# EAGLE design esquema v5 (EAGLE 9.6.2)
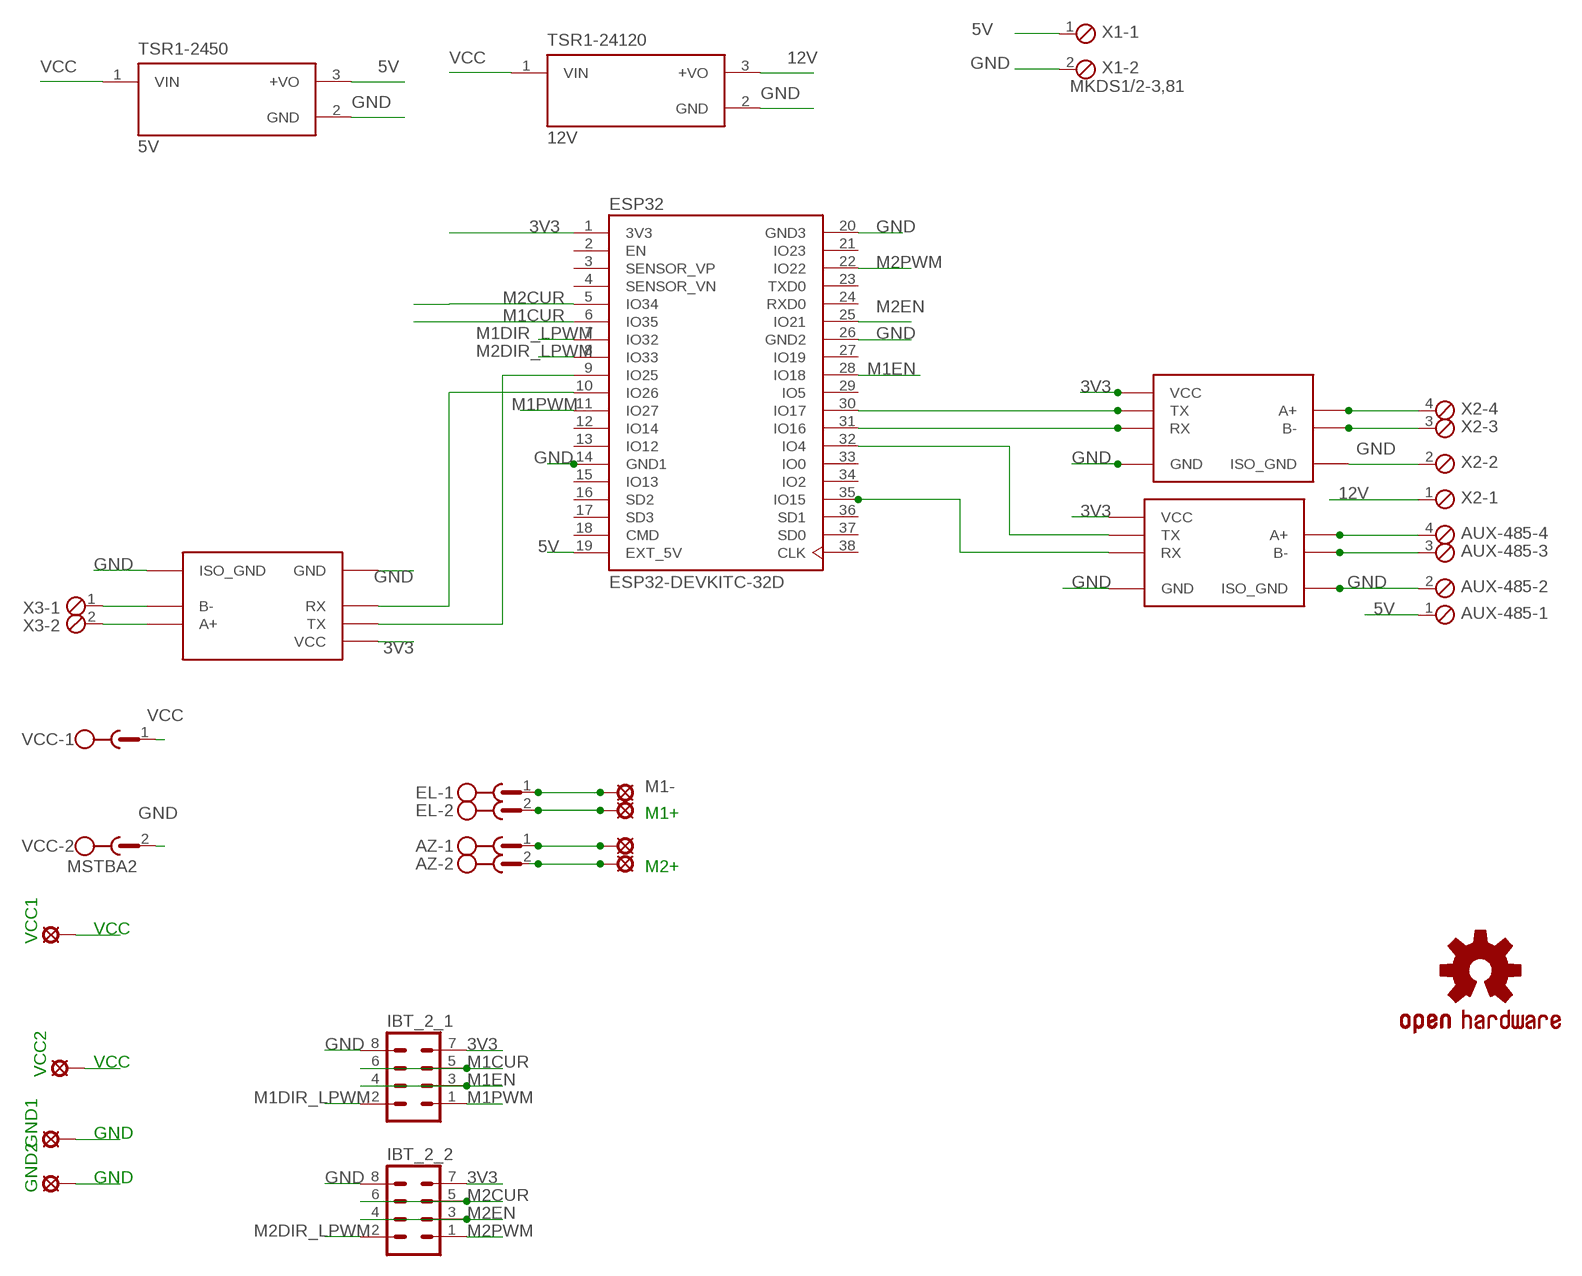
[diagram p0: schematic, sheet 1]

## Parts
AUX-485  MKDS1/4-3,81  [4POL381]
AZ  MSTBA2  [MSTBA2]
EL  MSTBA2  [MSTBA2]
ESP32  ESP32-DEVKITC-32D  [MODULE_ESP32-DEVKITC-32D]
GND1  LSP10  [LSP10]
GND2  LSP10  [LSP10]
IBT_2_1  IBT_2_1  MA04-2  [MA04-2]
IBT_2_2  MA04-2  [MA04-2]
LOGO1  OSHW-LOGOMINI  [OSHW-LOGO-MINI]
M1+  LSP10  [LSP10]
M1-  LSP10  [LSP10]
M2  LIMNOTECH_SMC_RS485  [LIMNOTECH_SMC_RS485]
M2+  LSP10  [LSP10]
M2-  M2-  LSP10  [LSP10]
M3  LIMNOTECH_SMC_RS485  [LIMNOTECH_SMC_RS485]
M4  LIMNOTECH_SMC_RS485  [LIMNOTECH_SMC_RS485]
TSR1-2450  5V  K7803-500R3  [CONV_K7803-500R3]
TSR1-24120  12V  K7803-500R3  [CONV_K7803-500R3]
VCC  MSTBA2  [MSTBA2]
VCC1  LSP10  [LSP10]
VCC2  LSP10  [LSP10]
X1  MKDS1/2-3,81  [2POL381]
X2  MKDS1/4-3,81  [4POL381]
X3  MKDS1/2-3,81  [2POL381]

## Nets
3V3: ESP32.1(3V3) IBT_2_1.7 IBT_2_2.7 M2.VCC M3.VCC M4.VCC
5V: AUX-485.1 ESP32.19(EXT_5V) TSR1-2450.3(+VO) X1.1
12V: TSR1-24120.3(+VO) X2.1
GND [power]: AUX-485.2 ESP32.14(GND1) ESP32.20(GND3) ESP32.26(GND2) GND1.MP GND2.MP IBT_2_1.8 IBT_2_2.8 M2.GND M2.GND_ISO(ISO_GND) M3.GND M3.GND_ISO(ISO_GND) M4.GND M4.GND_ISO(ISO_GND) TSR1-2450.2(GND) TSR1-24120.2(GND) VCC.2 X1.2 X2.2
M1+ [power]: EL.2 M1+.MP
M1-: EL.1 M1-.MP
M1CUR: ESP32.6(IO35) IBT_2_1.5 IBT_2_1.6
M1DIR_LPWM: ESP32.7(IO32) IBT_2_1.2
M1EN: ESP32.28(IO18) IBT_2_1.3 IBT_2_1.4
M1PWM: ESP32.11(IO27) IBT_2_1.1
M2+ [power]: AZ.2 M2+.MP
M2CUR: ESP32.5(IO34) IBT_2_2.5 IBT_2_2.6
M2DIR_LPWM: ESP32.8(IO33) IBT_2_2.2
M2EN: ESP32.25(IO21) IBT_2_2.3 IBT_2_2.4
M2PWM: ESP32.22(IO22) IBT_2_2.1
N$1: M4.B- X2.3
N$2: AUX-485.4 M2.A+
N$3: AZ.1 M2-.MP
N$4: ESP32.32(IO4) M2.TX
N$5: ESP32.10(IO26) M3.RX
N$6: ESP32.9(IO25) M3.TX
N$7: ESP32.31(IO16) M4.RX
N$8: ESP32.30(IO17) M4.TX
N$9: M3.B- X3.1
N$10: M3.A+ X3.2
N$11: ESP32.35(IO15) M2.RX
N$12: AUX-485.3 M2.B-
N$24: M4.A+ X2.4
VCC [power]: TSR1-2450.1(VIN) TSR1-24120.1(VIN) VCC1.MP VCC2.MP VCC.1
Unconnected: ESP32.2(EN) ESP32.3(SENSOR_VP) ESP32.4(SENSOR_VN) ESP32.12(IO14) ESP32.13(IO12) ESP32.15(IO13) ESP32.16(SD2) ESP32.17(SD3) ESP32.18(CMD) ESP32.21(IO23) ESP32.23(TXD0) ESP32.24(RXD0) ESP32.27(IO19) ESP32.29(IO5) ESP32.33(IO0) ESP32.34(IO2) ESP32.36(SD1) ESP32.37(SD0) ESP32.38(CLK)

## Library data of the parts
AUX-485 X2 = con-phoenix-381:MKDS1/4-3,81: MKDS 1/4-3,81 - Order No. 1727036 Pitch: 3,81mm Number of terminals: 4 Rated Voltage: 160V Maximum load current/ cross section: 12A/1.5mm2-AWG16 Housing Interlocking: none Color: Green
AZ EL VCC = con-phoenix-508:MSTBA2: PHOENIX; MF: FARNELL; MPN: 1757242; OC_FARNELL: 3705171; OC_NEWARK: 71C4161
ESP32 = ESP32-DEVKITC-32D:ESP32-DEVKITC-32D: Eval Board For Esp-Wroom-32 Check prices <https://pricing.snapeda.com/parts/ESP32-DEVKITC-32D/Espressif%20Systems/view-part?ref=eda>; AVAILABILITY: Warning; DESCRIPTION: EVAL BOARD FOR ESP-WROOM-32; MF: Espressif Systems; MP: ESP32-DEVKITC-32D; PACKAGE: None; PRICE: None; PURCHASE-URL: https://pricing.snapeda.com/search/part/ESP32-DEVKITC-32D/?ref=eda
GND1 GND2 M1+ M1- M2+ M2- VCC1 VCC2 = solpad:LSP10: SOLDER PAD drill 1.0 mm, distributor Buerklin, 12H555
IBT_2_1 IBT_2_2 = con-lstb:MA04-2: PIN HEADER; OC_FARNELL: unknown; OC_NEWARK: unknown
LOGO1 = SparkFun-Aesthetics:OSHW-LOGO: Open-Source Hardware (OSHW) Logo This logo indicates the piece of hardware it is found on incorporates a OSHW license and/or adheres to the definition of open source hardware found here: http://freedomdefined.org/OSHW
M2-M4 = aamilibreria:LIMNOTECH_SMC_RS485: Layout for connecting SMC RS-485 module Module <https://www.amazon.com/SMAKN%C2%AE-Adapter-Serial-Converter-Module/dp/B010723BCE>
TSR1-2450 TSR1-24120 = K7803-500R3:K7803-500R3: DC/DC Converter Check availability <https://pricing.snapeda.com/parts/K7803-500R3/Mornsun%20America%2C%20LLC/view-part?ref=eda>; AVAILABILITY: In Stock; DESCRIPTION: Non-Isolated PoL Module DC DC Converter 1 Output 3.3V, -3.3V - - - 500mA, 300mA 4.75V, 7V - 36V, 32V Input; MF: Mornsun America, LLC; MP: K7803-500R3; PACKAGE: SIP-3-3 MORNSUN; PRICE: None; PURCHASE-URL: https://pricing.snapeda.com/search/part/K7803-500R3/?ref=eda
X1 X3 = con-phoenix-381:MKDS1/2-3,81: MKDS 1/2-3,81 - Order No. 1727010 (RS-Online - 101-5384) Pitch: 3,81mm Number of terminals: 2 Rated Voltage: 160V Maximum load current/ cross section: 12A/1.5mm2-AWG16 Housing Interlocking: none Color: Green

## Net classes
0 default: width 0.5 mm, drill 0.5 mm, clearance 0.5 mm
1 power: width 0.8 mm, clearance 0.5 mm

## Board
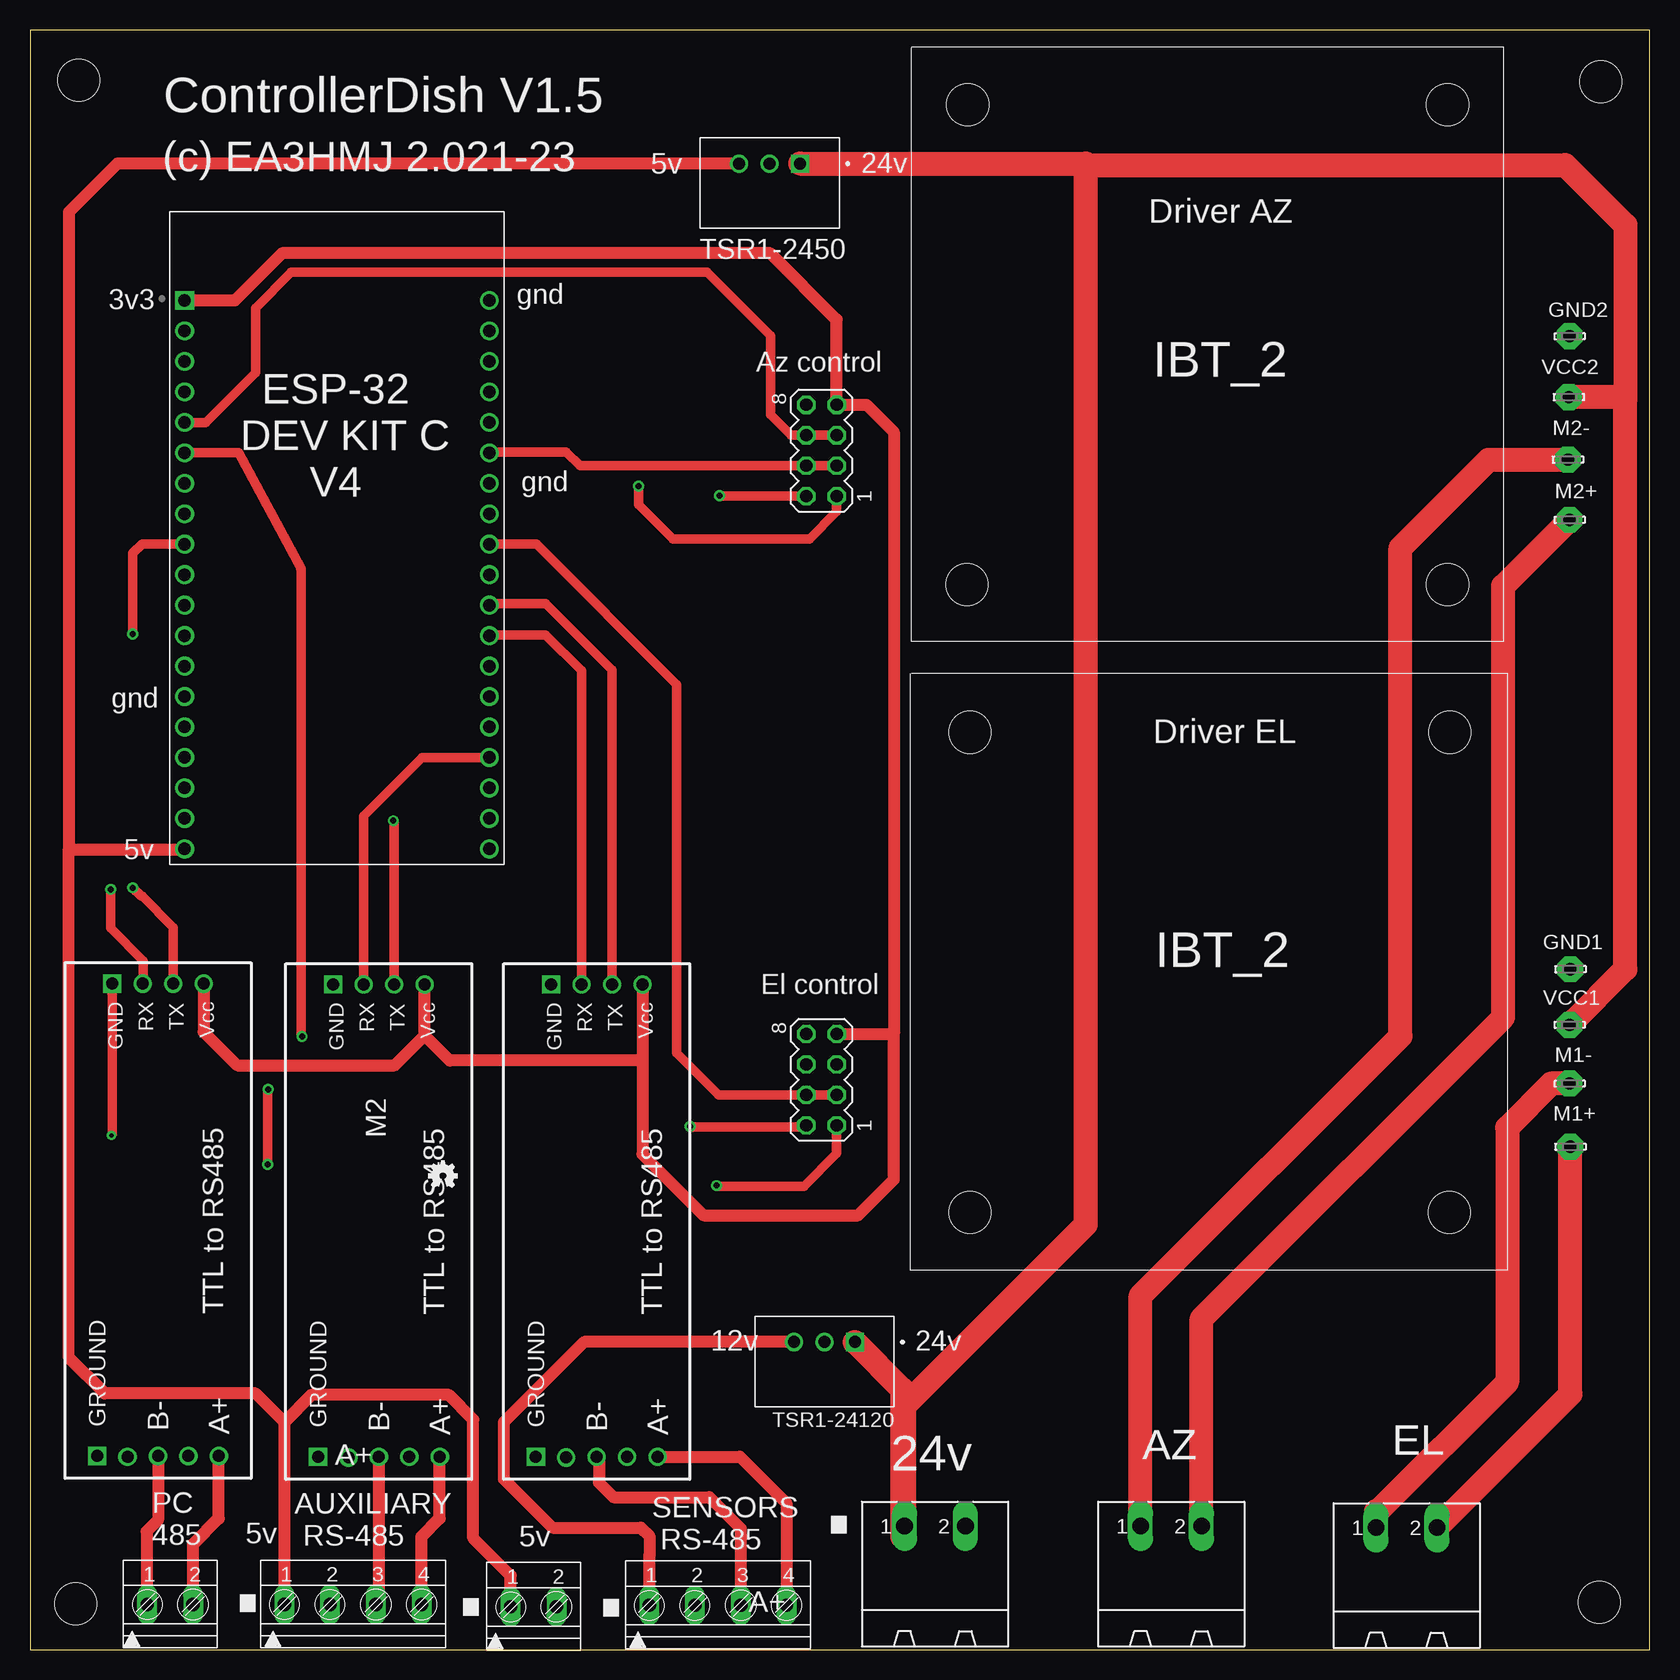
[diagram p1: board, top side]
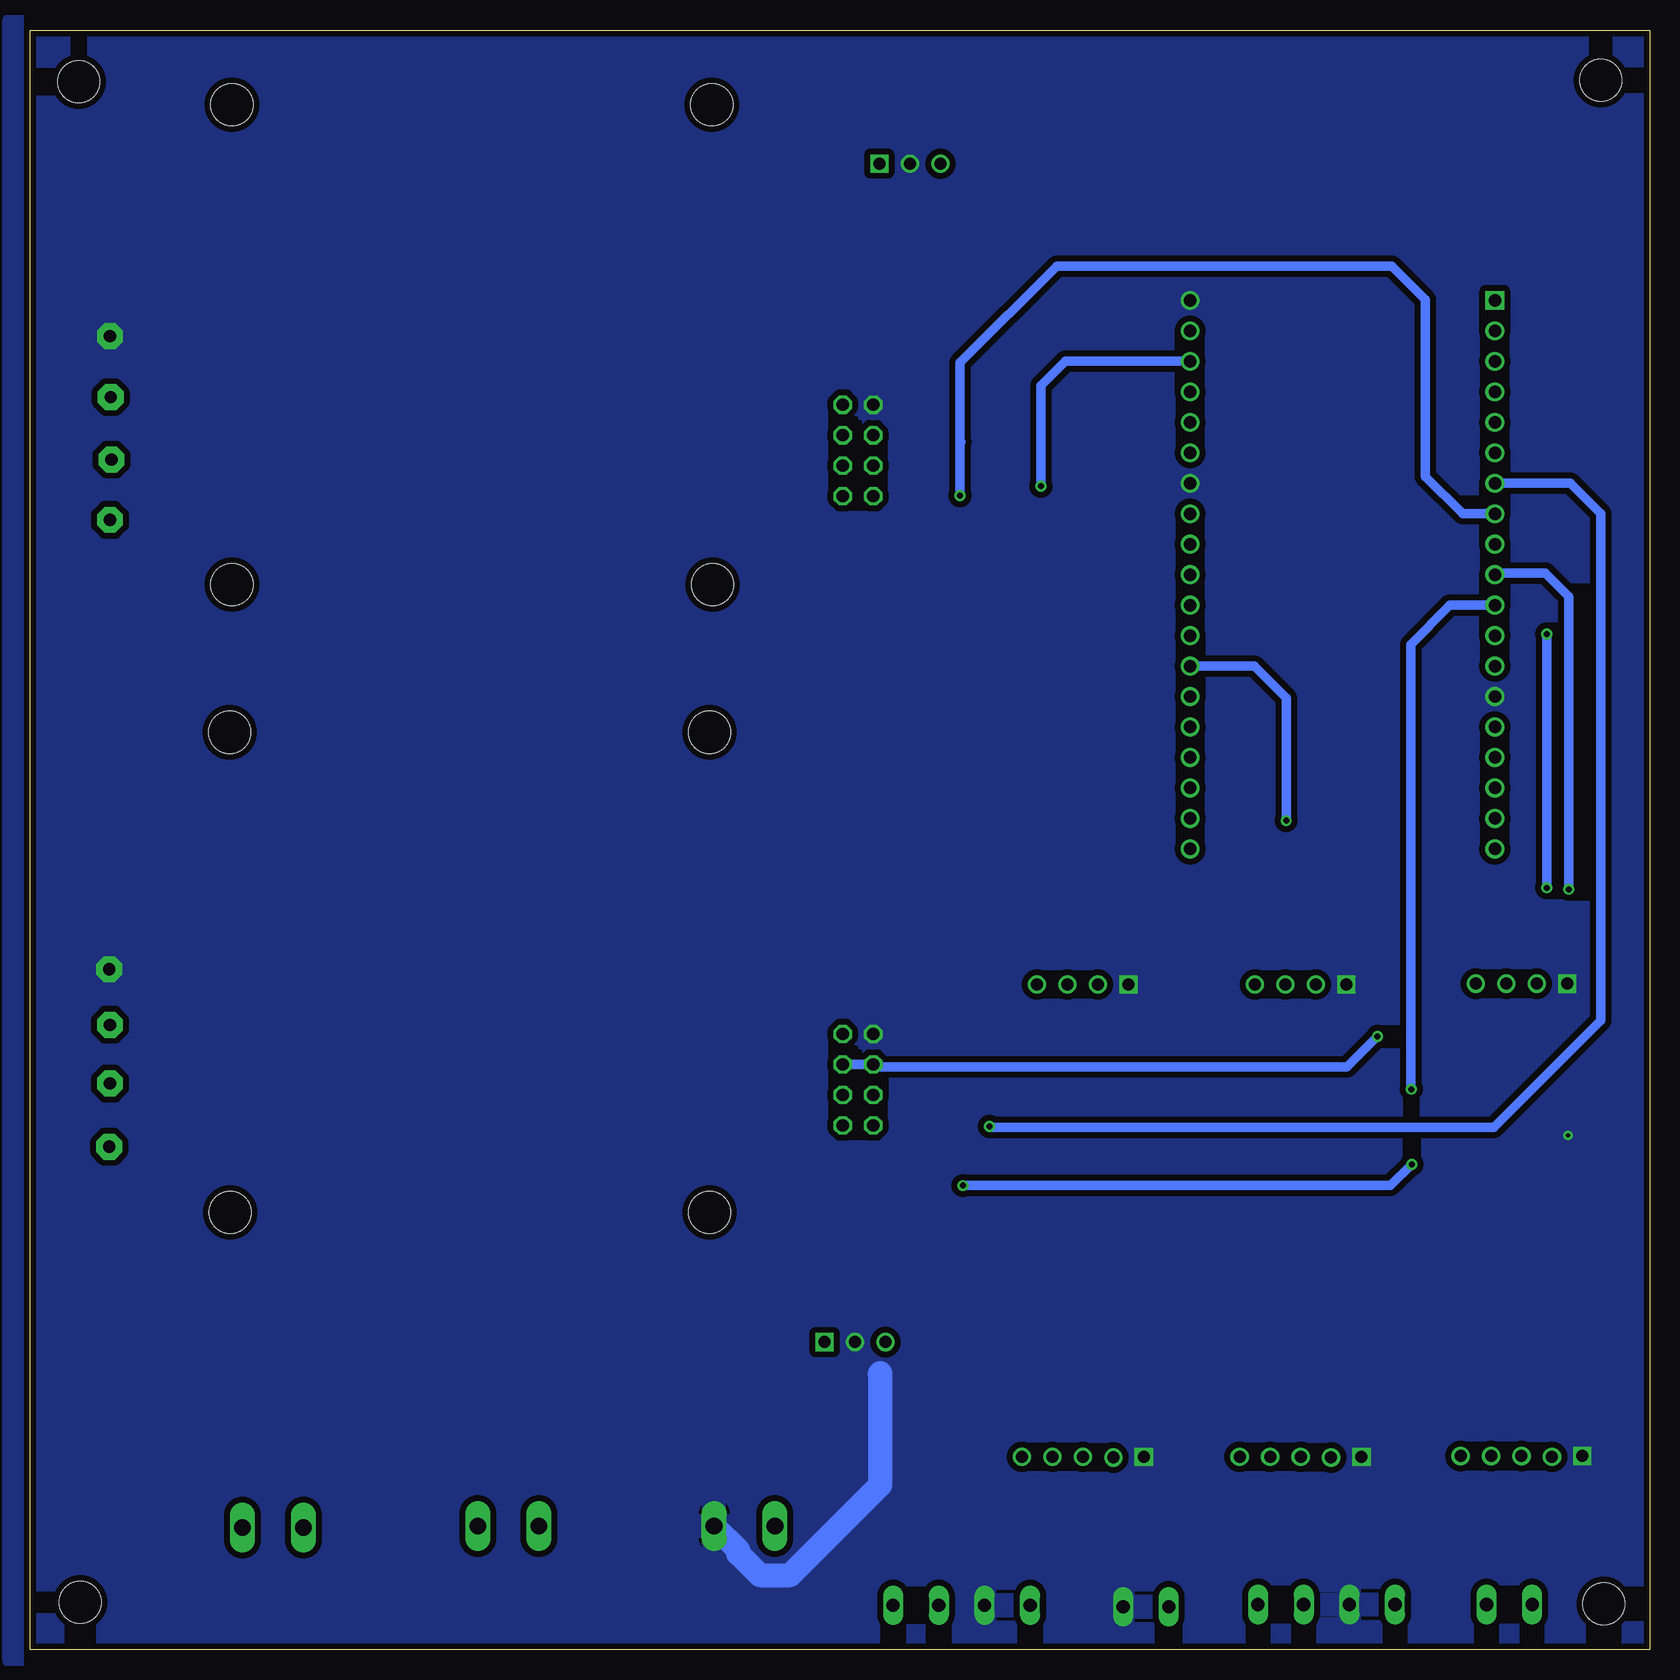
[diagram p2: board, bottom side, seen from below]

Size 135 x 135 mm. Coordinates in mm from the lower left corner, seen from the top.
Outline: 0,135 0,0 135,0 135,135 0,135
Copper layers (1*16): Top 0.035mm / dielectric 1.5mm / Bottom 0.035mm
Design rules "default *": minimum track width 6mil, minimum drill 0.35mm, track to track 6mil, track to pad 6mil, pad to pad 6mil, via to via 6mil, smd to smd 6mil, copper to edge 20mil, drill to drill 6mil, minimum pad ring 10mil, minimum via ring 8mil, stop-mask expansion 4mil, vias tented up to drill 0mil, thermal gap 10mil
Holes 3.5 mm at 3.81,3.81 4.06,130.81 130.81,3.94 130.94,130.68 78.17,128.78 118.17,128.78 78.11,88.77 118.17,88.77 118.36,76.45 78.36,76.45 118.3,36.45 78.36,36.45

### Footprints (pad centres in the part's own frame; a part is rotated, then mirrored left to right if it is on the bottom)
4POL381 = drill 1.1 long: 1 0,0; 2 3.81,0; 3 7.62,0; 4 11.43,0
MSTBA2 = drill 1.397 long: 1 -2.54,5.08; 2 2.54,5.08
MODULE_ESP32-DEVKITC-32D = drill 1.04 square: 1 -12.7,19.76 | drill 1.04: 2 -12.7,17.22; 3 -12.7,14.68; 4 -12.7,12.14; 5 -12.7,9.6; 6 -12.7,7.06; 7 -12.7,4.52; 8 -12.7,1.98; 9 -12.7,-0.56; 10 -12.7,-3.1; 11 -12.7,-5.64; 12 -12.7,-8.18; 13 -12.7,-10.72; 14 -12.7,-13.26; 15 -12.7,-15.8; 16 -12.7,-18.34; 17 -12.7,-20.88; 18 -12.7,-23.42; 19 -12.7,-25.96; 20 12.7,19.76; 21 12.7,17.22; 22 12.7,14.68; 23 12.7,12.14; 24 12.7,9.6; 25 12.7,7.06; 26 12.7,4.52; 27 12.7,1.98; 28 12.7,-0.56; 29 12.7,-3.1; 30 12.7,-5.64; 31 12.7,-8.18; 32 12.7,-10.72; 33 12.7,-13.26; 34 12.7,-15.8; 35 12.7,-18.34; 36 12.7,-20.88; 37 12.7,-23.42; 38 12.7,-25.96
LSP10 = drill 1.016 pad 2.159 octagon: MP 0,0
MA04-2 = drill 1.016 octagon: 1 -3.81,-1.27; 2 -3.81,1.27; 3 -1.27,-1.27; 4 -1.27,1.27; 5 1.27,-1.27; 6 1.27,1.27; 7 3.81,-1.27; 8 3.81,1.27
LIMNOTECH_SMC_RS485 = drill 1: A+ 19.623,5.08; B- 19.623,0; P$1 19.623,2.54; P$2 19.685,-2.54; RX -19.75,-1.27; TX -19.75,1.27; VCC -19.75,3.81 | drill 1 square: GND -19.75,-3.81; GND_ISO 19.623,-5.08
CONV_K7803-500R3 = drill 1 square: 1 -2.54,-1.625 | drill 1: 2 0,-1.625; 3 2.54,-1.625
2POL381 = drill 1.1 long: 1 0,0; 2 3.81,0

### Placement (x,y rotation side)
AUX-485  21.21,3.75 0 top
AZ  95.12,5.21 0 top
EL  114.74,5.08 0 top
ESP32  25.59,92.7 0 top
GND1  128.4,56.71 0 top
GND2  128.33,109.47 0 top
IBT_2_1  65.98,47.5 90 top
IBT_2_2  65.98,99.95 90 top
LOGO1  34.42,39.5 0 top
M1+  128.4,41.91 0 top
M1-  128.33,47.18 0 top
M2  29.08,35.69 270 top
M2+  128.33,94.17 0 top
M2-  128.21,99.19 0 top
M3  10.67,35.75 270 top
M4  47.24,35.69 270 top
TSR1-2450  61.66,122.24 180 top
TSR1-24120  66.23,24 180 top
VCC  75.44,5.21 0 top
VCC1  128.33,52.07 0 top
VCC2  128.27,104.39 0 top
X1  40.07,3.56 0 top
X2  51.63,3.68 0 top
X3  9.78,3.75 0 top

### Tracks (layer width: path | path; a pad name or v marks a point on that pad's centre or on a via)
3V3
  Top 0.8: M4.VCC 51.05,49.09 | 72.01,51.37 71.94,51.31
  Top 1.016: ESP32.1 17.08,112.46 21.02,116.39 61.72,116.39 67.25,110.87 IBT_2_2.7 69.72,103.76 72.01,101.47 72.01,51.37 72.01,39.18 69.03,36.2 56.13,36.2 51.05,41.27 M4.VCC | 51.05,49.09 34.99,49.09 32.89,51.18 | 32.89,51.18 M2.VCC | M3.VCC 14.48,51.5 17.27,48.7 30.42,48.7 32.89,51.18 | IBT_2_1.7 71.94,51.31
5V
  Top 0.8: 3.24,66.74 3.3,66.67 | 12.83,66.67 ESP32.19 | 21.21,2.6 AUX-485.1
  Top 1.016: TSR1-2450.3 7.28,123.86 3.24,119.83 3.24,66.74 3.24,24.32 6.22,21.34 18.8,21.34 21.21,18.92 | 3.3,66.67 12.83,66.67 | AUX-485.1 21.21,18.92 | X1.1 40.07,6.16 36.96,9.27 36.96,19.18 34.92,21.21 23.43,21.21 21.21,18.99 21.21,18.92
12V
  Top 0.8: 51.63,7.87 51.75,7.87
  Top 1.016: X2.1 51.63,7.87 51.63,9.46 50.93,10.16 43.56,10.16 39.5,14.22 39.5,18.92 46.2,25.63 TSR1-24120.3
GND  (via drill 0.35)
  Top 0.8: M3.GND 6.86,42.93 v6.79,42.86
  Bottom 2: VCC.2 75.95,8.26 75.95,7.98 74.16,6.19 71.64,6.19 64.11,13.72 64.11,23.03 | 64.11,23.03 64.11,23.04 | 64.11,23.03 64.18,22.96
  pour Bottom: -0.44,135.64 136.33,135.64 136.33,-0.76 -0.64,-0.76 -0.64,135.76
M1+
  Top 2: EL.2 128.4,21.27 M1+.MP
M1-
  Top 2: M1-.MP 126.81,47.18 123.13,43.5 123.13,22.29 112.39,11.56 112.2,11.56 EL.1
M1CUR  (via drill 0.5)
  Top 0.8: ESP32.6 17.4,99.76 22.61,90.11 22.54,90.04 22.61,89.98 22.61,51.12 v22.67,51.12
  Bottom 0.8: v22.67,51.12 25.21,48.58 64.52,48.58 IBT_2_1.6 IBT_2_1.5
M1DIR_LPWM  (via drill 0.5)
  Top 0.8: IBT_2_1.2 64.58,43.56 55.24,43.56 55.21,43.53 55.15,43.59 v55.02,43.59
  Bottom 0.8: v55.02,43.59 54.96,43.53 12.99,43.53 4.06,52.45 4.06,94.68 6.6,97.22 ESP32.7
M1EN
  Top 0.8: ESP32.28 42.23,92.14 53.91,80.45 53.91,49.72 57.4,46.23 IBT_2_1.4 IBT_2_1.3
M1PWM  (via drill 0.5)
  Top 0.8: IBT_2_1.1 67.25,41.34 64.52,38.61 57.21,38.61 v57.21,38.67 | v19.81,40.45 19.81,46.67 v19.84,46.7
  Bottom 0.8: v57.21,38.67 21.59,38.67 v19.81,40.45 | v19.84,46.7 19.91,46.77 19.91,83.79 16.64,87.06 ESP32.11
M2+
  Top 2: AZ.2 97.66,27.56 122.81,52.7 122.81,88.65 M2+.MP
M2CUR
  Top 0.8: ESP32.5 12.9,102.28 14.66,102.28 18.8,106.42 18.8,111.82 21.77,114.8 56.45,114.8 61.72,109.53 61.72,102.93 63.44,101.22 IBT_2_2.6 IBT_2_2.5
M2DIR_LPWM  (via drill 0.5)
  Top 0.8: IBT_2_2.2 57.47,96.14 v57.47,96.2
  Bottom 0.8: 57.4,100.65 57.47,100.65 v57.47,96.2 57.47,107.25 49.4,115.32 21.46,115.32 18.67,112.52 18.67,97.79 15.56,94.68 ESP32.8
M2EN
  Top 0.8: IBT_2_2.3 IBT_2_2.4 45.85,98.68 44.7,99.82 38.35,99.82 ESP32.25
M2PWM  (via drill 0.5)
  Top 0.8: IBT_2_2.1 67.25,94.87 64.96,92.58 53.59,92.58 50.74,95.44 v50.74,96.97
  Bottom 0.8: v50.74,96.97 50.74,105.35 48.71,107.38 ESP32.22
N$1
  Top 0.8: M4.B- 47.43,15.87
  Top 1.016: 47.43,15.87 47.43,13.91 48.64,12.7 56.64,12.7 59.24,10.1 X2.3
N$2
  Top 1.016: AUX-485.4 32.64,9.4 34.16,10.92 M2.A+
N$3
  Top 2: AZ.1 92.58,29.46 114.24,51.12 114.24,91.82 121.6,99.19 M2-.MP
N$4  (via drill 0.5)
  Top 0.8: M2.TX 30.35,69.09 v30.29,69.09
  Bottom 0.8: ESP32.32 32.96,81.98 30.29,79.31 v30.29,69.09
N$5  (via drill 0.5)
  Top 0.8: M3.RX 9.46,55.56 9.46,57.41 6.73,60.13 v6.73,63.37
  Bottom 0.8: v6.73,63.37 6.73,87.76 8.7,89.72 12.76,89.72 ESP32.10
N$6  (via drill 0.5)
  Top 0.8: M3.TX 11.94,60.2 9.34,62.8 9.27,62.8 v8.57,63.5 | v8.57,84.64 8.57,91.38 9.34,92.14 ESP32.9
  Bottom 0.8: v8.57,84.64 v8.57,63.5
N$7
  Top 0.8: M4.RX 45.97,81.6 42.99,84.58 38.35,84.58 ESP32.31
N$8
  Top 0.8: M4.TX 48.51,81.66 42.99,87.19 38.42,87.19 ESP32.30
N$9
  Top 0.8: 9.72,3.81 X3.1
  Top 1.016: M3.B- 10.67,10.79 9.72,9.84 9.72,3.81
N$10
  Top 1.016: X3.2 13.59,8.76 15.75,10.92 M3.A+
N$11
  Top 0.8: ESP32.35 32.7,74.36 27.81,69.47 M2.RX
N$12
  Top 0.8: 29.08,4 AUX-485.3
  Top 1.016: M2.B- 29.08,4
N$24
  Top 1.016: M4.A+ 59.18,16.06 63.06,12.19 X2.4
VCC
  Top 2: VCC1.MP 132.98,56.72 132.98,104.2 | 132.98,104.2 132.79,104.39 VCC2.MP | TSR1-2450.1 88.01,123.86 88.01,123.74 | 88.01,123.74 127.98,123.74 132.98,118.73 132.98,104.2 | TSR1-24120.1 72.71,21.69 72.71,9.4 72.9,9.59 VCC.1 72.9,20.32 88.01,35.43 88.01,123.74

### Text on the board
tPlace: Driver AZ | TSR1-2450 | Driver EL | . | . | . | .
tNames: ControllerDish V1.5 | (c) EA3HMJ 2.021-23 | 5v | 24v | 3v3 | gnd | Az control | IBT_2 | DEV KIT C | ESP-32 | gnd | V4 | gnd | 5v | IBT_2 | El control | 12v | 24v | A+ | 24v | PC / 485 | 5v | AUXILIARY / RS-485 | 5v | SENSORS / RS-485 | A+